# EAGLE schematic emg-ps-usb (EAGLE 6.5.0)
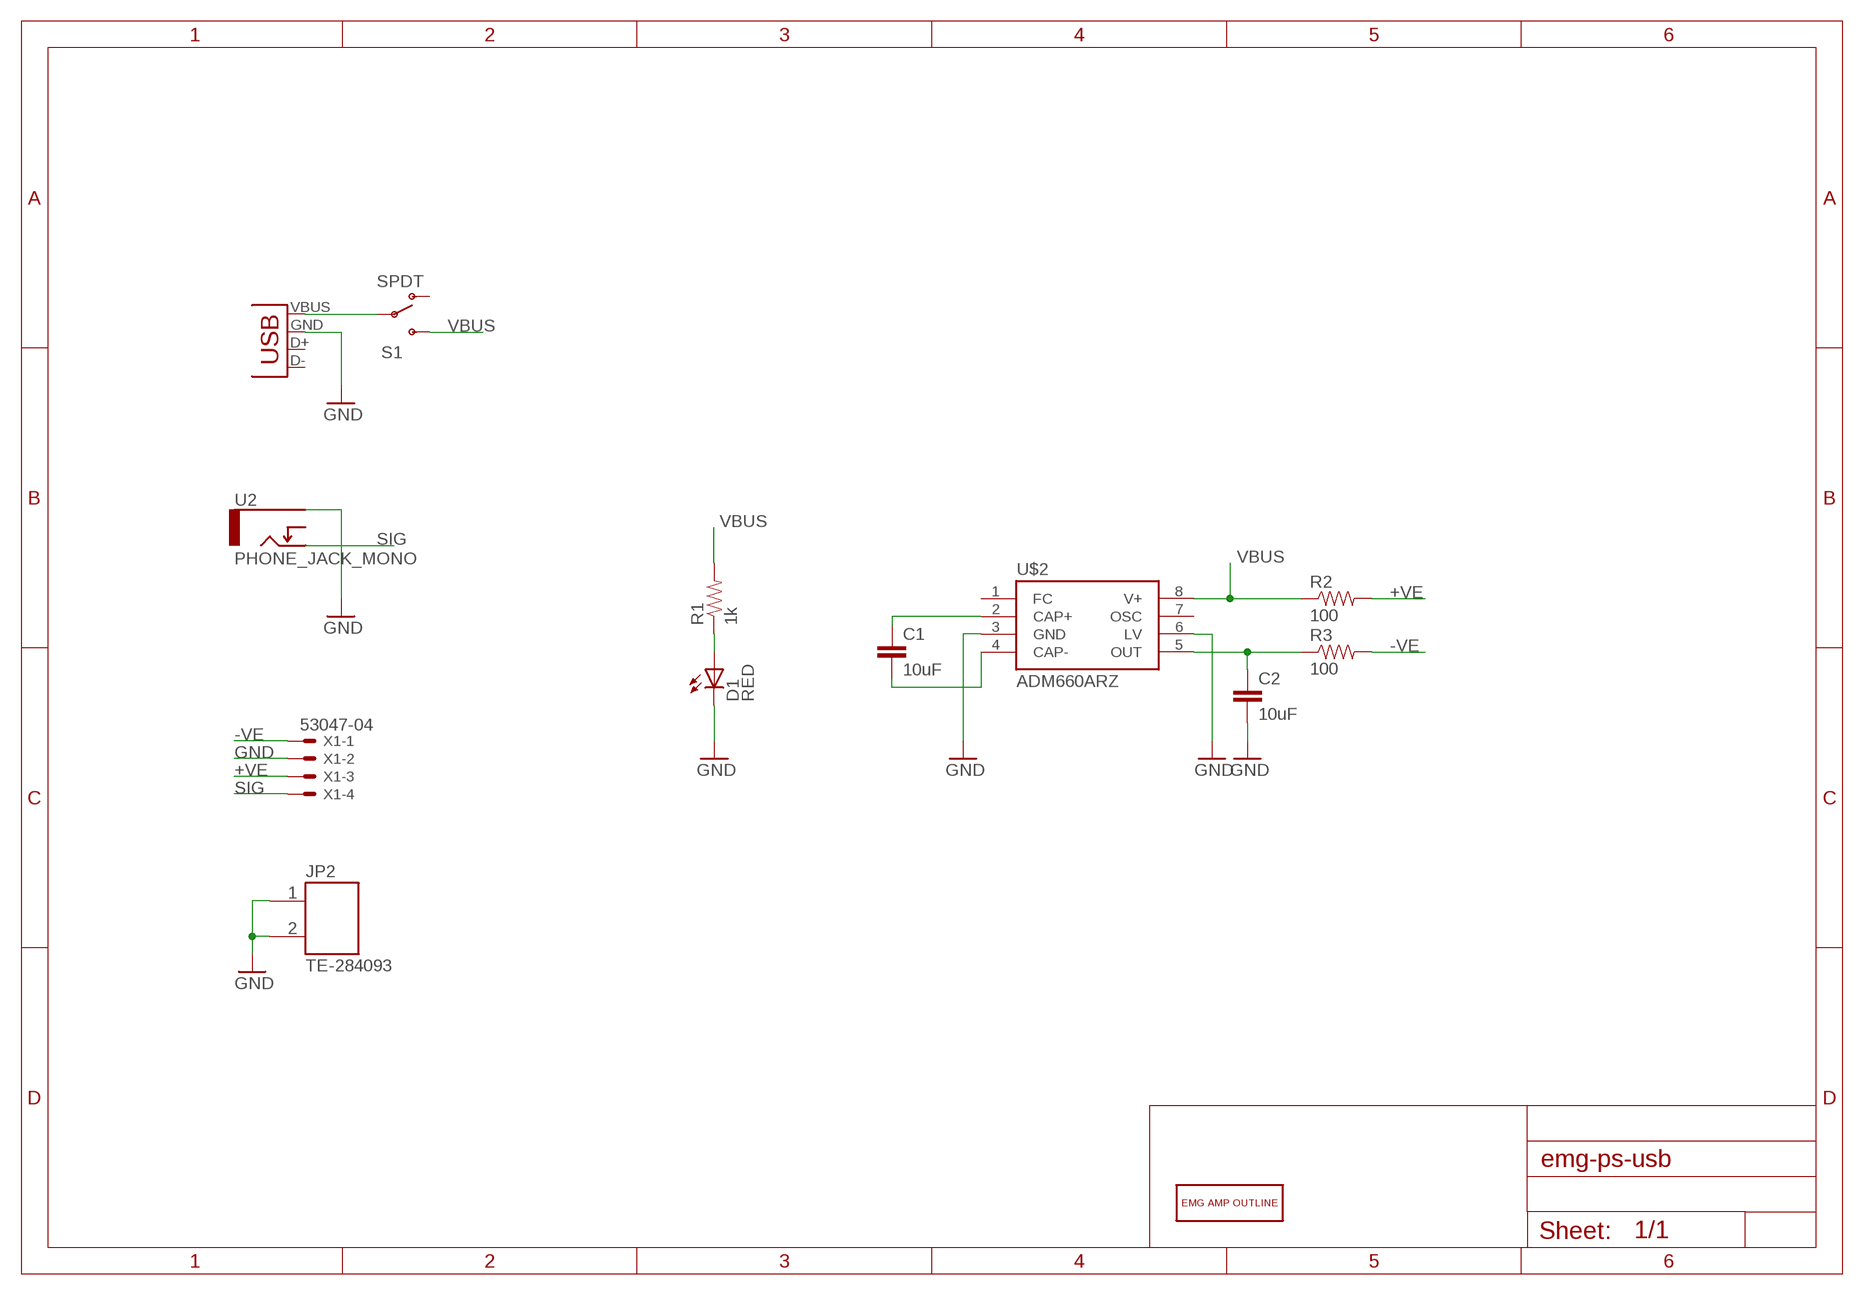
[diagram p0: schematic, sheet 1]

## Parts
C1  10uF  CAP0805  [0805]
C2  10uF  CAP0805  [0805]
D1  RED  LED-RED0603  [LED-0603]
JP1  USB-A-H  [USB-A-H]
JP2  TE-284093  [TE-284093]
R1  1k  RESISTOR0805-RES  [0805]
R2  100  RESISTOR0805-RES  [0805]
R3  100  RESISTOR0805-RES  [0805]
S1  SPDT  SWITCH-SPDT-SMD-A  [SWITCH-SPST-SMD-A]
U2  PHONE_JACK_MONO  [MJ-3523-SMT]
U$2  ADM660ARZ  [SOIC8]
U$3  EMG_AMP_OUTLINE-Y03ENDS  [EMG_Y03_OUTLINEENDS]
X1  53047-04  [53047-04]

## Nets
+VE: R2.2 X1.3
-VE: R3.2 X1.1
GND: C2.2 D1.C JP1.GND(VBUS) JP2.P$1 JP2.P$2 U2.P$1 U$2.3(GND) U$2.6(LV) X1.2
N$1: JP1.VBUS(GND) S1.2(P)
N$3: D1.A R1.1
N$4: C2.1 R3.1 U$2.5(OUT)
N$5: C1.2 U$2.4(CAP-)
N$6: C1.1 U$2.2(CAP+)
SIG: U2.P$2 X1.4
VBUS: R1.2 R2.1 S1.3(S) U$2.8(V+)
Unconnected: JP1.D+(D-) JP1.D-(D+) S1.1(O) U2.P$3 U$2.1(FC) U$2.7(OSC)

## Library data of the parts
C1 C2 = SparkFun-Capacitors:CAP: Capacitor Standard 0603 ceramic capacitor, and 0.1" leaded capacitor.
D1 = SparkFun-LED:LED-RED: Assorted Red LEDs LilyPad 1206- DIO-09912 1206- DIO-00809 0603- DIO-00819; PROD_ID: DIO-00819
JP1 = SparkFun-Connectors:USB: USB Connectors USB-B-PTH is fully proven SKU : PRT-00139/CONN-08278 USB-miniB is fully proven SKU : PRT-00587 USB-A-PCB is untested. USB-A-H is throughly reviewed, but untested. Spark Fun Electronics SKU : PRT-00437 USB-B-SMT is throughly reviewed, but untested. Needs silkscreen touching up. USB-A-S has not been used/tested USB-MB-H has not been used/tested USB-MICROB has been used. CONN-09505
JP2 = eagle-lib:TE-284093
R1-R3 = SparkFun-Resistors:RESISTOR: Resistor Basic schematic elements and footprints for 0603, 1206, and PTH resistors.
S1 = SparkFun-Electromechanical:SWITCH-SPDT: SPDT Switch Simple slide switch, Spark Fun Electronics SKU : COM-00102 DPDT SMT slide switch, AYZ0202, SWCH-08179
U2 = eagle-lib:PHONE_JACK_MONO
U$2 = eagle-lib:ADM660: Analog Devices charge-pump voltage converter that can be used to either invert the input supply voltage or double it. Input voltages ranging from +1.5V to +7V can be inverted into a negative -1.5V to -7V output supply. Datasheet: http://www.analog.com/static/imported-files/data_sheets/ADM660_8660.pdf
U$3 = ucdrascal-eagle-lib:EMG_AMP_OUTLINE
X1 = con-molex:53?-04: CONNECTOR wire to board 1.25 mm (.049 inch) pitch header; MF: WALDOM/MOLEX; MPN: 53047-0410; OC_FARNELL: 9733060; OC_NEWARK: 38C9900